# EAGLE design Sensor de Nivel Ultra-Sonido (EAGLE 7.5.0)
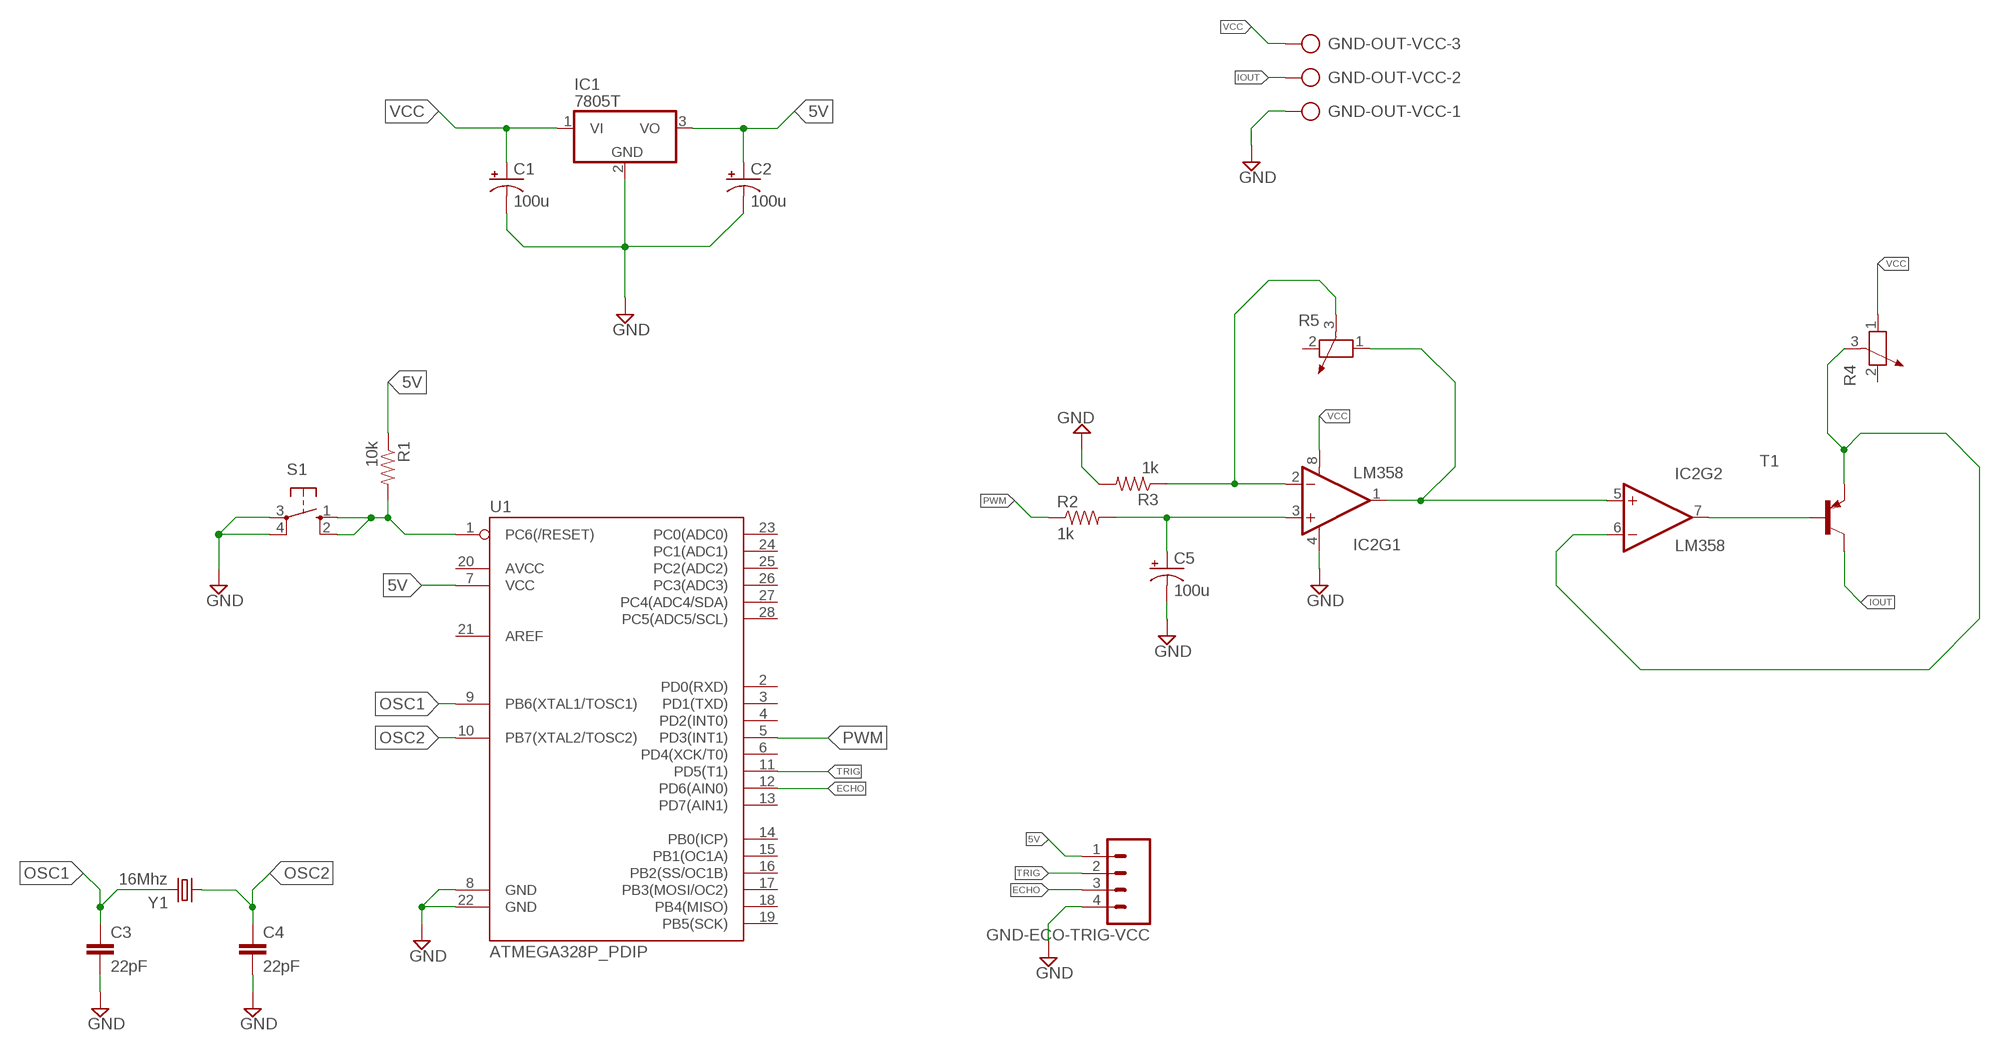
[diagram p0: schematic, sheet 1]

## Parts
C1  100u  10UF-25V-20%(PTH)KIT  [CPOL-RADIAL-10UF-25V-KIT]
C2  100u  10UF-25V-20%(PTH)KIT  [CPOL-RADIAL-10UF-25V-KIT]
C3  22pF  0.1UF-50V-20%(PTH)KIT-EZ  [CAP-PTH-SMALL-KIT]
C4  22pF  0.1UF-50V-20%(PTH)KIT-EZ  [CAP-PTH-SMALL-KIT]
C5  100u  10UF-25V-20%(PTH)KIT  [CPOL-RADIAL-10UF-25V-KIT]
GND-ECO-TRIG-VCC  M04LONGPADS  [1X04_LONGPADS]
GND-OUT-VCC  AK500/3  [AK500/3]
IC1  7805T  [TO220H]
IC2  LM358  [DIP08]
R1  10k  RESISTORKIT  [AXIAL-0.3-KIT]
R2  1k  RESISTORKIT  [AXIAL-0.3-KIT]
R3  1k  RESISTORKIT  [AXIAL-0.3-KIT]
R4  POTENTIOMETER_PT_SPIN  [PT-SPIN]
R5  POTENTIOMETER_PT_SPIN  [PT-SPIN]
S1  10-XX  [B3F-10XX]
T1  BC558A-PNP-TO92-EBC  [TO92-EBC]
U1  ATMEGA328P_PDIP  [DIL28-3]
Y1  16Mhz  CRYSTALHC49US  [HC49US]

## Nets
5V: C2.1(+) GND-ECO-TRIG-VCC.1 IC1.3(VO) R1.P$1 U1.7(VCC)
ECHO: GND-ECO-TRIG-VCC.3 U1.12(PD6(AIN0))
GND: C1.2(-) C2.2(-) C3.2 C4.2 C5.2(-) GND-ECO-TRIG-VCC.4 GND-OUT-VCC.1 IC1.2(GND) IC2.4(V-) R3.P$2 S1.3(P) S1.4(P1) U1.8(GND) U1.22(GND)
IOUT: GND-OUT-VCC.2 T1.C
N$1: R1.P$2 S1.1(S) S1.2(S1) U1.1(PC6(/RESET))
N$2: C5.1(+) IC2.3(+IN) R2.P$2
N$3: IC2.2(-IN) R3.P$1 R5.3
N$4: IC2.7(OUT) T1.B
N$5: IC2.1(OUT) IC2.5(+IN) R5.1
N$6: IC2.6(-IN) R4.3 T1.E
OSC1: C3.1 U1.9(PB6(XTAL1/TOSC1)) Y1.2
OSC2: C4.1 U1.10(PB7(XTAL2/TOSC2)) Y1.1
PWM: R2.P$1 U1.5(PD3(INT1))
TRIG: GND-ECO-TRIG-VCC.2 U1.11(PD5(T1))
VCC: C1.1(+) GND-OUT-VCC.3 IC1.1(VI) IC2.8(V+) R4.1
Unconnected: R4.2 R5.2 U1.2(PD0(RXD)) U1.3(PD1(TXD)) U1.4(PD2(INT0)) U1.6(PD4(XCK/T0)) U1.13(PD7(AIN1)) U1.14(PB0(ICP)) U1.15(PB1(OC1A)) U1.16(PB2(SS/OC1B)) U1.17(PB3(MOSI/OC2)) U1.18(PB4(MISO)) U1.19(PB5(SCK)) U1.20(AVCC) U1.21(AREF) U1.23(PC0(ADC0)) U1.24(PC1(ADC1)) U1.25(PC2(ADC2)) U1.26(PC3(ADC3)) U1.27(PC4(ADC4/SDA)) U1.28(PC5(ADC5/SCL))

## Library data of the parts
C1 C2 C5 = SparkFun-Capacitors:10UF-25V-20%(PTH): CAP-08440; PROD_ID: CAP-08440
C3 C4 = SparkFun-Capacitors:0.1UF-50V-20%(PTH): CAP-08370; PROD_ID: CAP-08370
GND-ECO-TRIG-VCC = SparkFun-Connectors:M04: Header 4 Standard 4-pin 0.1" header. Use with straight break away headers (SKU : PRT-00116), right angle break away headers (PRT-00553), swiss pins (PRT-00743), machine pins (PRT-00117), and female headers (PRT-00115). Molex polarized connector foot print use with SKU : PRT-08231 with associated crimp pins and housings. 1MM SMD Version SKU: PRT-10208
GND-OUT-VCC = con-ptr500:AK500/3: CONNECTOR; OC_FARNELL: unknown; OC_NEWARK: unknown
IC1 = linear:78*: Positive VOLTAGE REGULATOR Source: http://cache.national.com/ds/LM/LM78L05.pdf http://www.fairchildsemi.com/ds/LM/LM7805.pdf
IC2 = SparkFun-AnalogIC:LM358: Jellybean op-amp; PROD_ID: IC-09172
R1-R3 = SparkFun-Passives:RESISTOR: Resistor Basic schematic elements and footprints for 0603, 1206, and PTH resistors.
R4 R5 = rcl:POTENTIOMETER_: Potentiometer
S1 = switch-omron:10-XX: OMRON SWITCH; MPN: B3F-1000; OC_FARNELL: 176432; OC_NEWARK: 36M3542
T1 = transistor:*-PNP-: PNP Transistror
U1 = SparkFun-DigitalIC:ATMEGA328P_PDIP: uC used in the Arduino 32kb flash, 1k EEPROM, 2k SRAM This is the through-hole version of this chip.
Y1 = SparkFun-FreqCtrl:CRYSTAL: Various standard crystals. Proven footprints.

## Board
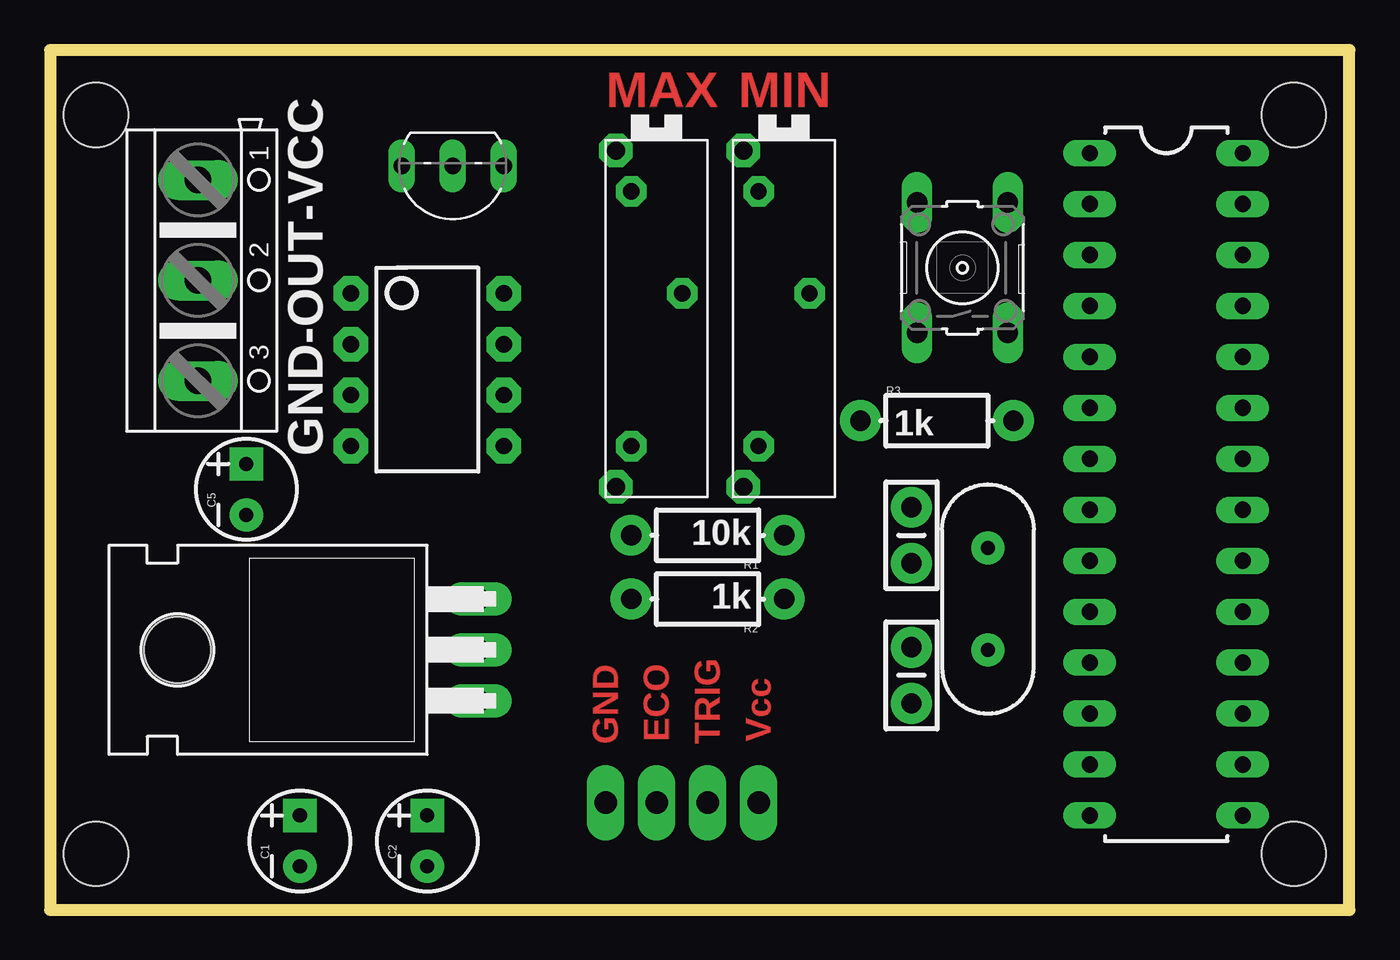
[diagram p1: board, top side]
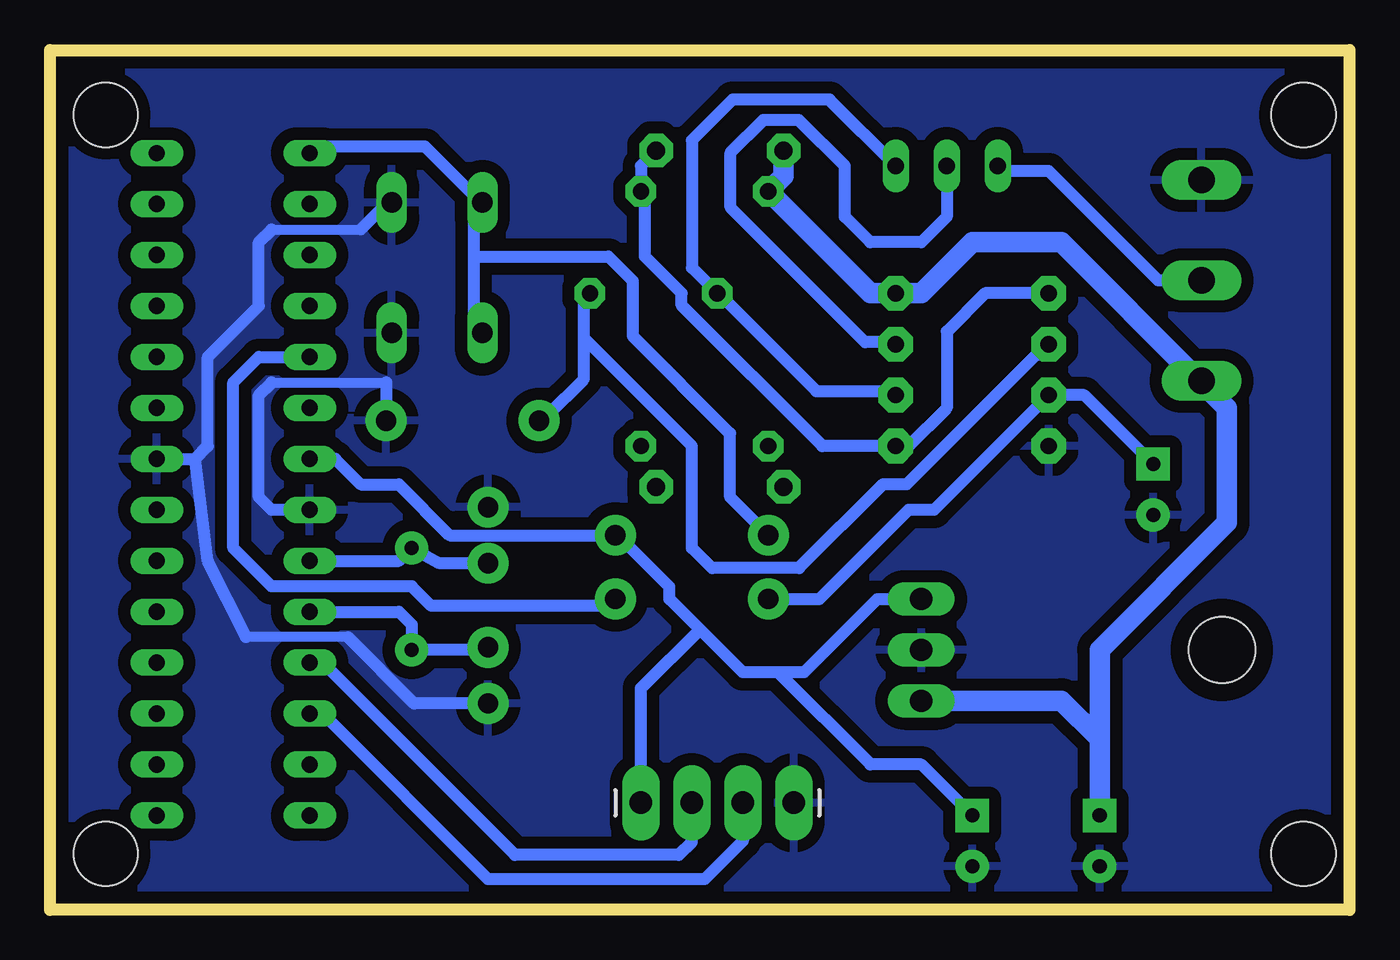
[diagram p2: board, bottom side, seen from below]

Size 64.75 x 42.85 mm. Coordinates in mm from the lower left corner, seen from the top.
Outline: 0,0 64.75,0 64.75,42.85 0,42.85 0,0
Copper layers (1*16): Top 0.035mm / dielectric 1.5mm / Bottom 0.035mm
Design rules "default *": minimum track width 24mil, minimum drill 24mil, track to track 24mil, track to pad 24mil, pad to pad 24mil, via to via 24mil, smd to smd 8mil, copper to edge 24mil, drill to drill 8mil, minimum pad ring 10mil, minimum via ring 8mil, stop-mask expansion 4mil, vias tented up to drill 0mil, thermal gap 24mil
Holes 3.2 mm at 2.29,39.62 61.98,39.62 61.98,2.79 2.29,2.79

### Footprints (pad centres in the part's own frame; a part is rotated, then mirrored left to right if it is on the bottom)
CPOL-RADIAL-10UF-25V-KIT = drill 0.7 pad 1.651 square: 1 1.27,0 | drill 0.7 pad 1.651: 2 -1.27,0
CAP-PTH-SMALL-KIT = drill 1.016 pad 2.032: 1 -1.397,0; 2 1.397,0
1X04_LONGPADS = drill 1.118 pad 1.88 long: 1 0,0; 2 2.54,0; 3 5.08,0; 4 7.62,0
AK500/3 = drill 1.321 long: 1 -5.004,0; 2 0,0; 3 5.004,0
TO220H = drill 1.118 long: 1 -2.54,-10.16; 2 0,-10.16; 3 2.54,-10.16 | hole 3.302: 0,4.826
DIP08 = drill 0.813 pad 1.727 octagon: 1 -3.81,-3.81; 2 -1.27,-3.81; 3 1.27,-3.81; 4 3.81,-3.81; 5 3.81,3.81; 6 1.27,3.81; 7 -1.27,3.81; 8 -3.81,3.81
AXIAL-0.3-KIT = drill 1.016 pad 2.032: P$1 -3.81,0; P$2 3.81,0
PT-SPIN = drill 0.813 pad 1.524 octagon: 1 -6.35,-1.27; 2 6.35,-1.27; 3 -1.27,1.27
B3F-10XX = drill 1.016 long: 1 -3.251,2.261; 2 3.251,2.261; 3 -3.251,-2.261; 4 3.251,-2.261
TO92-EBC = drill 0.813 long: B 0,-1.27; C 2.54,-1.27; E -2.54,-1.27
DIL28-3 = drill 0.813 long: 1 -16.51,-3.81; 2 -13.97,-3.81; 3 -11.43,-3.81; 4 -8.89,-3.81; 5 -6.35,-3.81; 6 -3.81,-3.81; 7 -1.27,-3.81; 8 1.27,-3.81; 9 3.81,-3.81; 10 6.35,-3.81; 11 8.89,-3.81; 12 11.43,-3.81; 13 13.97,-3.81; 14 16.51,-3.81; 15 16.51,3.81; 16 13.97,3.81; 17 11.43,3.81; 18 8.89,3.81; 19 6.35,3.81; 20 3.81,3.81; 21 1.27,3.81; 22 -1.27,3.81; 23 -3.81,3.81; 24 -6.35,3.81; 25 -8.89,3.81; 26 -11.43,3.81; 27 -13.97,3.81; 28 -16.51,3.81
HC49US = drill 0.7 pad 1.651: 1 -2.54,0; 2 2.54,0

### Placement (x,y rotation side)
C1  12.45,3.43 90 top
C2  18.8,3.43 90 top
C3  42.93,18.67 90 top
C4  42.93,11.68 270 top
C5  9.78,20.95 90 top
GND-ECO-TRIG-VCC  35.31,5.33 0 bottom
GND-OUT-VCC  7.37,31.37 270 top
IC1  11.18,12.95 90 top
IC2  18.8,26.92 270 top
R1  32.77,18.67 180 top
R2  32.77,15.49 180 top
R3  44.2,24.38 0 top
R4  30.23,29.46 270 top
R5  36.58,29.46 270 top
S1  45.47,32 90 top
T1  20.07,35.81 180 top
U1  55.63,21.21 270 top
Y1  46.74,15.49 90 top

### Tracks (layer width: path | path; a pad name or v marks a point on that pad's centre or on a via)
5V
  Bottom 0.61: 32.37,13.98 30.23,11.84 28.47,11.84 | 32.37,13.98 33.88,15.49 33.88,16.1 36.32,18.54 R1.P$1 44.83,18.67 47.37,21.21 49.28,21.21 50.55,22.48 U1.7 | 28.47,11.84 27.18,11.84 23.52,15.49 IC1.3 | GND-ECO-TRIG-VCC.1 35.31,11.05 32.37,13.98 | C2.1 21.34,7.24 23.88,7.24 28.47,11.84
ECHO
  Bottom 0.61: GND-ECO-TRIG-VCC.3 30.23,3.43 32.13,1.52 42.93,1.52 51.18,9.78 U1.12
GND
  Bottom 0.508: 53.72,26.29 48.01,26.29 | 53.72,33.91 49.28,33.91 | 49.91,13.59 54.99,13.59
  Bottom 0.61: U1.8 53.72,19.94 54.36,20.57 54.36,25.65 53.72,26.29 | 48.01,26.29 R3.P$2 | U1.22 57.53,22.48 | 57.53,22.48 56.9,23.11 56.9,27.56 54.36,30.1 54.36,33.27 53.72,33.91 | 49.28,33.91 47.93,35.26 S1.4 | C4.2 46.61,10.29 49.91,13.59 | 54.99,13.59 56.9,17.4 57.53,22.48
  pour Bottom: 0,0 0,42.55 64.77,42.55 64.77,0
IOUT
  Bottom 0.61: T1.C 17.42,36.83 14.99,36.83 9.53,31.37 GND-OUT-VCC.2
N$1
  Bottom 0.61: U1.1 51.56,38.05 46.08,38.05 43.64,35.61 S1.2 43.64,35 43.64,32.56 | 43.64,32.56 43.64,28.91 S1.1 | 43.64,32.56 36.93,32.56 35.71,31.34 35.71,28.6 30.86,23.75 30.86,20.57 R1.P$2
N$2
  Bottom 0.61: R2.P$2 26.42,15.49 21.97,19.94 20.7,19.94 IC2.3 13.21,25.65 C5.1
N$3
  Bottom 0.61: 38.15,28.5 38.15,26.47 39.98,24.64 R3.P$1 | 38.15,28.5 38.15,30.73 R5.3 | IC2.2 14.99,27.69 15.6,27.69 22.07,21.21 23.24,21.21 27.42,17.03 31.76,17.03 32.77,18.03 32.77,23.11 38.15,28.5
N$4
  Bottom 0.61: IC2.7 22.91,28.3 24.13,28.3 30.84,35 30.84,37.74 29.21,39.37 27.43,39.37 25.15,37.08 25.15,34.54 23.88,33.27 21.34,33.27 20.07,34.54 T1.B
N$5  (via drill 0.9 pad 1.68)
  Bottom 0.61: IC2.1 18.16,30.73 20.07,28.83 20.07,25.02 21.97,23.11 IC2.5 26.26,23.11 33.27,30.12 33.27,30.73 35.1,32.56 35.1,35.61 R5.1 35.31,37.08 v34.54,37.85
N$6
  Bottom 0.61: IC2.6 22.91,25.86 26.57,25.86 31.45,30.73 R4.3 32.77,32 32.77,38.35 30.73,40.39 25.91,40.39 T1.E
N$9  (via drill 0.9 pad 1.68)
  other vias: 28.19,21.08
N$10  (via drill 0.9 pad 1.68)
  other vias: 34.54,21.08
OSC1
  Bottom 0.61: U1.9 47.37,17.4 Y1.2 45.34,17.27 C3.1
OSC2
  Bottom 0.61: U1.10 47.37,14.86 46.74,14.22 Y1.1 43.05,12.95 C4.1
PWM
  Bottom 0.61: U1.5 54.36,27.56 55.63,26.29 55.63,18.03 53.72,16.13 46.74,16.13 45.76,15.16 36.91,15.16 R2.P$1
TRIG
  Bottom 0.61: GND-ECO-TRIG-VCC.2 32.77,3.39 33.43,2.73 41.59,2.73 51.18,12.32 U1.11
VCC  (via drill 0.9 pad 1.68)
  Bottom 1.016: GND-OUT-VCC.3 7.44,26.36 | 7.44,26.36 14.35,33.27 18.8,33.27 21.34,30.73 IC2.8 23.88,30.73 R4.1 28.19,36.58 v28.19,37.85 | IC1.1 14.35,10.41 12.45,8.51 | 12.45,8.51 C1.1 | 7.44,26.36 6.1,25.02 6.1,19.3 12.45,12.95 12.45,8.51

### Text on the board
Top: MAX | MIN | GND | ECO | TRIG | Vcc